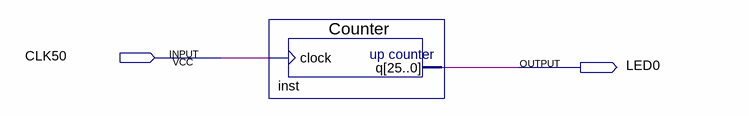
[diagram p0: schematic sheet]
// Quartus schematic LED_Blink.bdf as structural Verilog: 1 symbols, 2 pins
module LED_Blink (
  input  CLK50,
  output LED0
);

  Counter inst (.clock(CLK50), .q(LED0));
endmodule
